# EAGLE design usbSimStepper (EAGLE 5.06)
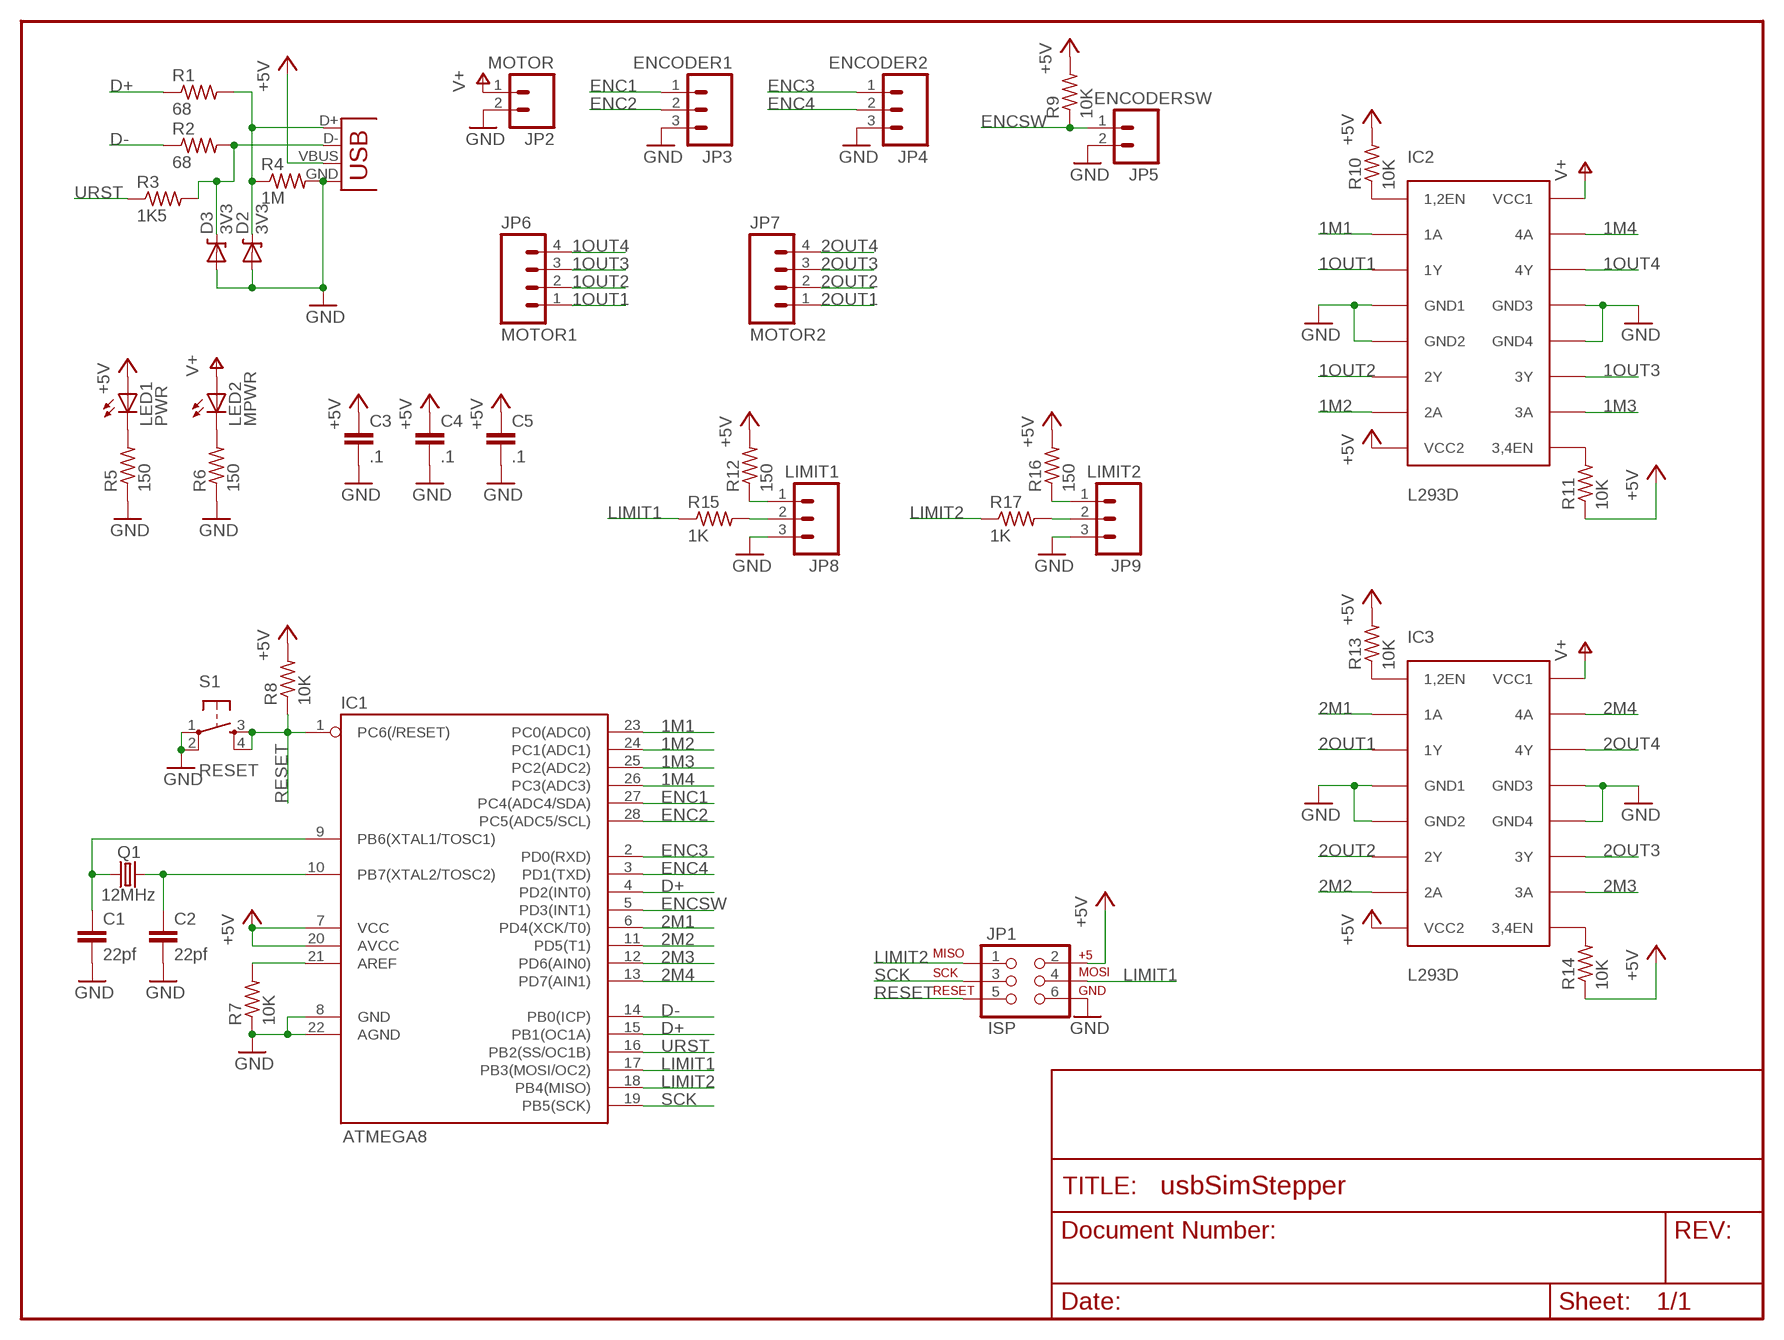
[diagram p0: schematic, sheet 1]

## Parts
C1  22pf  CAPPTH2  [CAP-PTH-SMALL2]
C2  22pf  CAPPTH2  [CAP-PTH-SMALL2]
C3  .1  CAPPTH2  [CAP-PTH-SMALL2]
C4  .1  CAPPTH2  [CAP-PTH-SMALL2]
C5  .1  CAPPTH2  [CAP-PTH-SMALL2]
D2  3V3  DIODE-ZENERPTH  [DIODE-ZENER]
D3  3V3  DIODE-ZENERPTH  [DIODE-ZENER]
IC1  ATMEGA8  AVR-MEGA8-PPTH  [DIL28-3]
IC2  L293D  [DIL16]
IC3  L293D  [DIL16]
JP1  ISP  AVR_SPI_PRG_6NS  [2X3-NS]
JP2  MOTOR  M02POLAR  [MOLEX-1X2]
JP3  ENCODER1  M03POLAR  [MOLEX-1X3]
JP4  ENCODER2  M03POLAR  [MOLEX-1X3]
JP5  ENCODERSW  M02POLAR  [MOLEX-1X2]
JP6  MOTOR1  M04POLAR  [MOLEX-1X4]
JP7  MOTOR2  M04POLAR  [MOLEX-1X4]
JP8  LIMIT1  M03POLAR  [MOLEX-1X3]
JP9  LIMIT2  M03POLAR  [MOLEX-1X3]
LED1  PWR  LED5MM  [LED5MM]
LED2  MPWR  LED5MM  [LED5MM]
Q1  12MHz  CRYSTALHC49US  [HC49US]
R1  68  R-US_0204/7  [0204/7]
R2  68  R-US_0204/7  [0204/7]
R3  1K5  R-US_0204/7  [0204/7]
R4  1M  R-US_0204/7  [0204/7]
R5  150  R-US_0204/7  [0204/7]
R6  150  R-US_0204/7  [0204/7]
R7  10K  R-US_0204/7  [0204/7]
R8  10K  R-US_0204/7  [0204/7]
R9  10K  R-US_0204/7  [0204/7]
R10  10K  R-US_0204/7  [0204/7]
R11  10K  R-US_0204/7  [0204/7]
R12  150  R-US_0204/7  [0204/7]
R13  10K  R-US_0204/7  [0204/7]
R14  10K  R-US_0204/7  [0204/7]
R15  1K  R-US_0204/7  [0204/7]
R16  150  R-US_0204/7  [0204/7]
R17  1K  R-US_0204/7  [0204/7]
S1  RESET  TAC_SWITCHPTH  [TACTILE-PTH]
X1  USB  USBPTH-VERTICAL  [USB-B-PTH-VERTICAL]

## Nets
1M1: IC1.23(PC0(ADC0)) IC2.2(1A)
1M2: IC1.24(PC1(ADC1)) IC2.7(2A)
1M3: IC1.25(PC2(ADC2)) IC2.10(3A)
1M4: IC1.26(PC3(ADC3)) IC2.15(4A)
1OUT1: IC2.3(1Y) JP6.1
1OUT2: IC2.6(2Y) JP6.2
1OUT3: IC2.11(3Y) JP6.3
1OUT4: IC2.14(4Y) JP6.4
2M1: IC1.6(PD4(XCK/T0)) IC3.2(1A)
2M2: IC1.11(PD5(T1)) IC3.7(2A)
2M3: IC1.12(PD6(AIN0)) IC3.10(3A)
2M4: IC1.13(PD7(AIN1)) IC3.15(4A)
2OUT1: IC3.3(1Y) JP7.1
2OUT2: IC3.6(2Y) JP7.2
2OUT3: IC3.11(3Y) JP7.3
2OUT4: IC3.14(4Y) JP7.4
+5V: C3.1 C4.1 C5.1 IC1.7(VCC) IC1.20(AVCC) IC2.8(VCC2) IC3.8(VCC2) JP1.2 LED1.A R8.2 R9.2 R10.2 R11.1 R12.2 R13.2 R14.1 R16.2 X1.VBUS
D+: IC1.4(PD2(INT0)) IC1.15(PB1(OC1A)) R1.1
D-: IC1.14(PB0(ICP)) R2.1
ENC1: IC1.27(PC4(ADC4/SDA)) JP3.1
ENC2: IC1.28(PC5(ADC5/SCL)) JP3.2
ENC3: IC1.2(PD0(RXD)) JP4.1
ENC4: IC1.3(PD1(TXD)) JP4.2
ENCSW: IC1.5(PD3(INT1)) JP5.1 R9.1
GND: C1.2 C2.2 C3.2 C4.2 C5.2 D2.P$2(A) D3.P$2(A) IC1.8(GND) IC1.22(AGND) IC2.4(GND1) IC2.5(GND2) IC2.12(GND4) IC2.13(GND3) IC3.4(GND1) IC3.5(GND2) IC3.12(GND4) IC3.13(GND3) JP1.6 JP2.2 JP3.3 JP4.3 JP5.2 JP8.3 JP9.3 R4.2 R5.1 R6.1 R7.1 S1.1 S1.2 X1.GND
LIMIT1: IC1.17(PB3(MOSI/OC2)) JP1.4 R15.1
LIMIT2: IC1.18(PB4(MISO)) JP1.1 R17.1
N$1: D3.P$1(C) R2.2 R3.2 X1.D-
N$2: D2.P$1(C) R1.2 R4.1 X1.D+
N$3: LED1.K(C) R5.2
N$4: LED2.K(C) R6.2
N$5: C1.1 IC1.9(PB6(XTAL1/TOSC1)) Q1.1
N$6: C2.1 IC1.10(PB7(XTAL2/TOSC2)) Q1.2
N$7: IC1.21(AREF) R7.2
N$8: JP8.1 R12.1
N$9: JP8.2 R15.2
N$10: JP9.1 R16.1
N$11: IC3.1(1,2EN) R13.1
N$12: IC3.9(3,4EN) R14.2
N$13: IC2.1(1,2EN) R10.1
N$14: IC2.9(3,4EN) R11.2
N$15: JP9.2 R17.2
RESET: IC1.1(PC6(/RESET)) JP1.5 R8.1 S1.3 S1.4
SCK: IC1.19(PB5(SCK)) JP1.3
URST: IC1.16(PB2(SS/OC1B)) R3.1
V+: IC2.16(VCC1) IC3.16(VCC1) JP2.1 LED2.A

## Library data of the parts
C1-C5 = SparkFun:CAP: Capacitor Standard 0603 ceramic capacitor, and 0.1" leaded capacitor.
D2 D3 = SparkFun:DIODE-ZENER: Zener Diode Production Part - 8199 3.4V Zener Voltage
IC1 = SparkFun:AVR-MEGA8-P: MICROCONTROLLER 8 Kbytes FLASH 1 kbytes SRAM 512 bytes EEPROM USART 4-channel 10 bit ADC 2-channel 8 bit ADC
IC2 IC3 = sgs-thom:L293D
JP1 = SparkFun:AVR_SPI_PRG_6: AVR ISP 6 Pin This is the reduced ISP connector for AVR programming. Common on Arduino. This footprint will take up less PCB space and can be used with a 10-pin to 6-pin adapter such as SKU: BOB-08508
JP2 JP5 = SparkFun:M02: Header 2 Standard 2-pin 0.1" header. Use with straight break away headers (SKU : PRT-00116), right angle break away headers (PRT-00553), swiss pins (PRT-00743), machine pins (PRT-00117), and female headers (PRT-00115). Molex polarized connector foot print use with SKU : PRT-08233 with associated crimp pins and housings.
JP3 JP4 JP8 JP9 = SparkFun:M03: Header 3 Standard 3-pin 0.1" header. Use with straight break away headers (SKU : PRT-00116), right angle break away headers (PRT-00553), swiss pins (PRT-00743), machine pins (PRT-00117), and female headers (PRT-00115). Molex polarized connector foot print use with SKU : PRT-08232 with associated crimp pins and housings.
JP6 JP7 = SparkFun:M04: Header 4 Standard 4-pin 0.1" header. Use with straight break away headers (SKU : PRT-00116), right angle break away headers (PRT-00553), swiss pins (PRT-00743), machine pins (PRT-00117), and female headers (PRT-00115). Molex polarized connector foot print use with SKU : PRT-08231 with associated crimp pins and housings.
LED1 LED2 = SparkFun:LED: LEDs Standard schematic elements and footprints for 5mm, 3mm, 1206, and 0603 sized LEDs. 5mm - Spark Fun Electronics SKU : COM-00529 (and others)
Q1 = SparkFun:CRYSTAL: Crystals Various standard crystals. Proven footprints. Spark Fun Electronics SKU : COM-00534
R1-R17 = resistor:R-US_: RESISTOR, American symbol
S1 = SparkFun:TAC_SWITCH: Momentary Switch Button commonly used for reset or general input. Spark Fun Electronics SKU : COM-00097
X1 = SparkFun:USB: USB Connectors USB-B-PTH is fully proven SKU : PRT-00139 USB-miniB is fully proven SKU : PRT-00587 USB-A-PCB is untested. USB-A-H is throughly reviewed, but untested. Spark Fun Electronics SKU : PRT-00437 USB-B-SMT is throughly reviewed, but untested. Needs silkscreen touching up. USB-A-S has not been used/tested USB-MB-H has not been used/tested

## Board
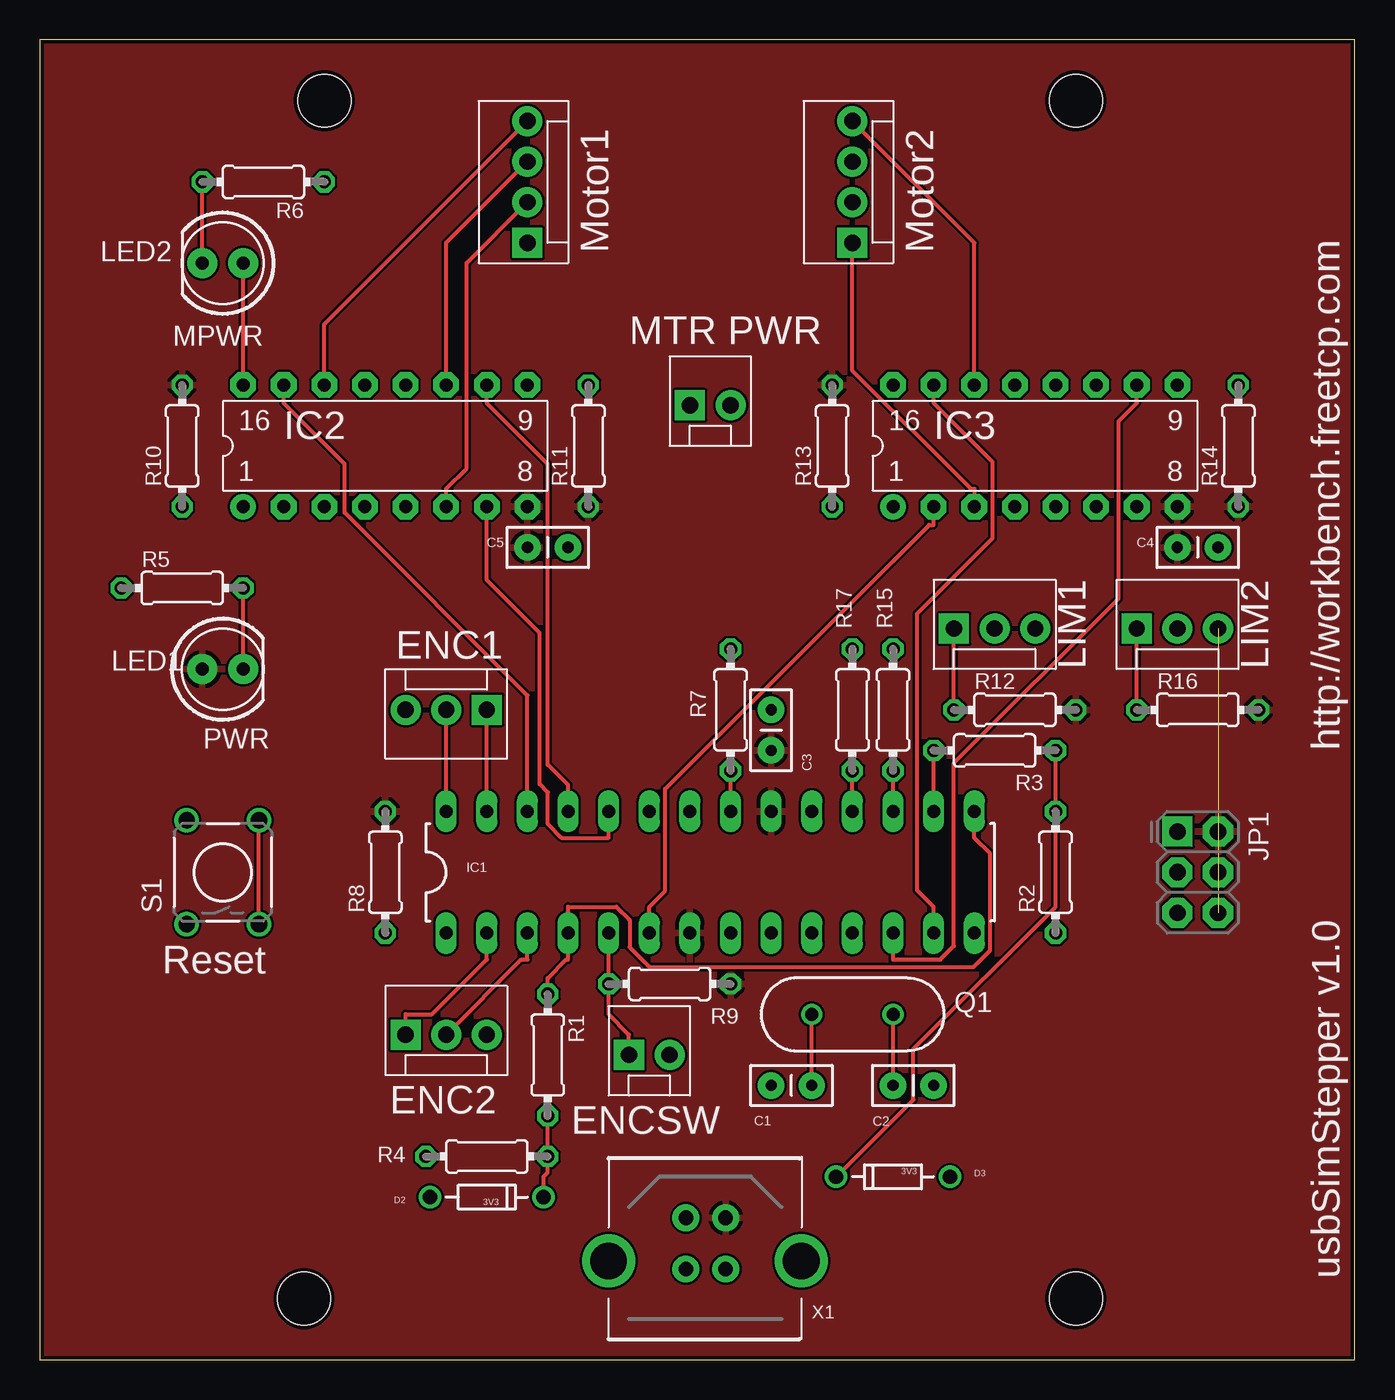
[diagram p1: board, top side]
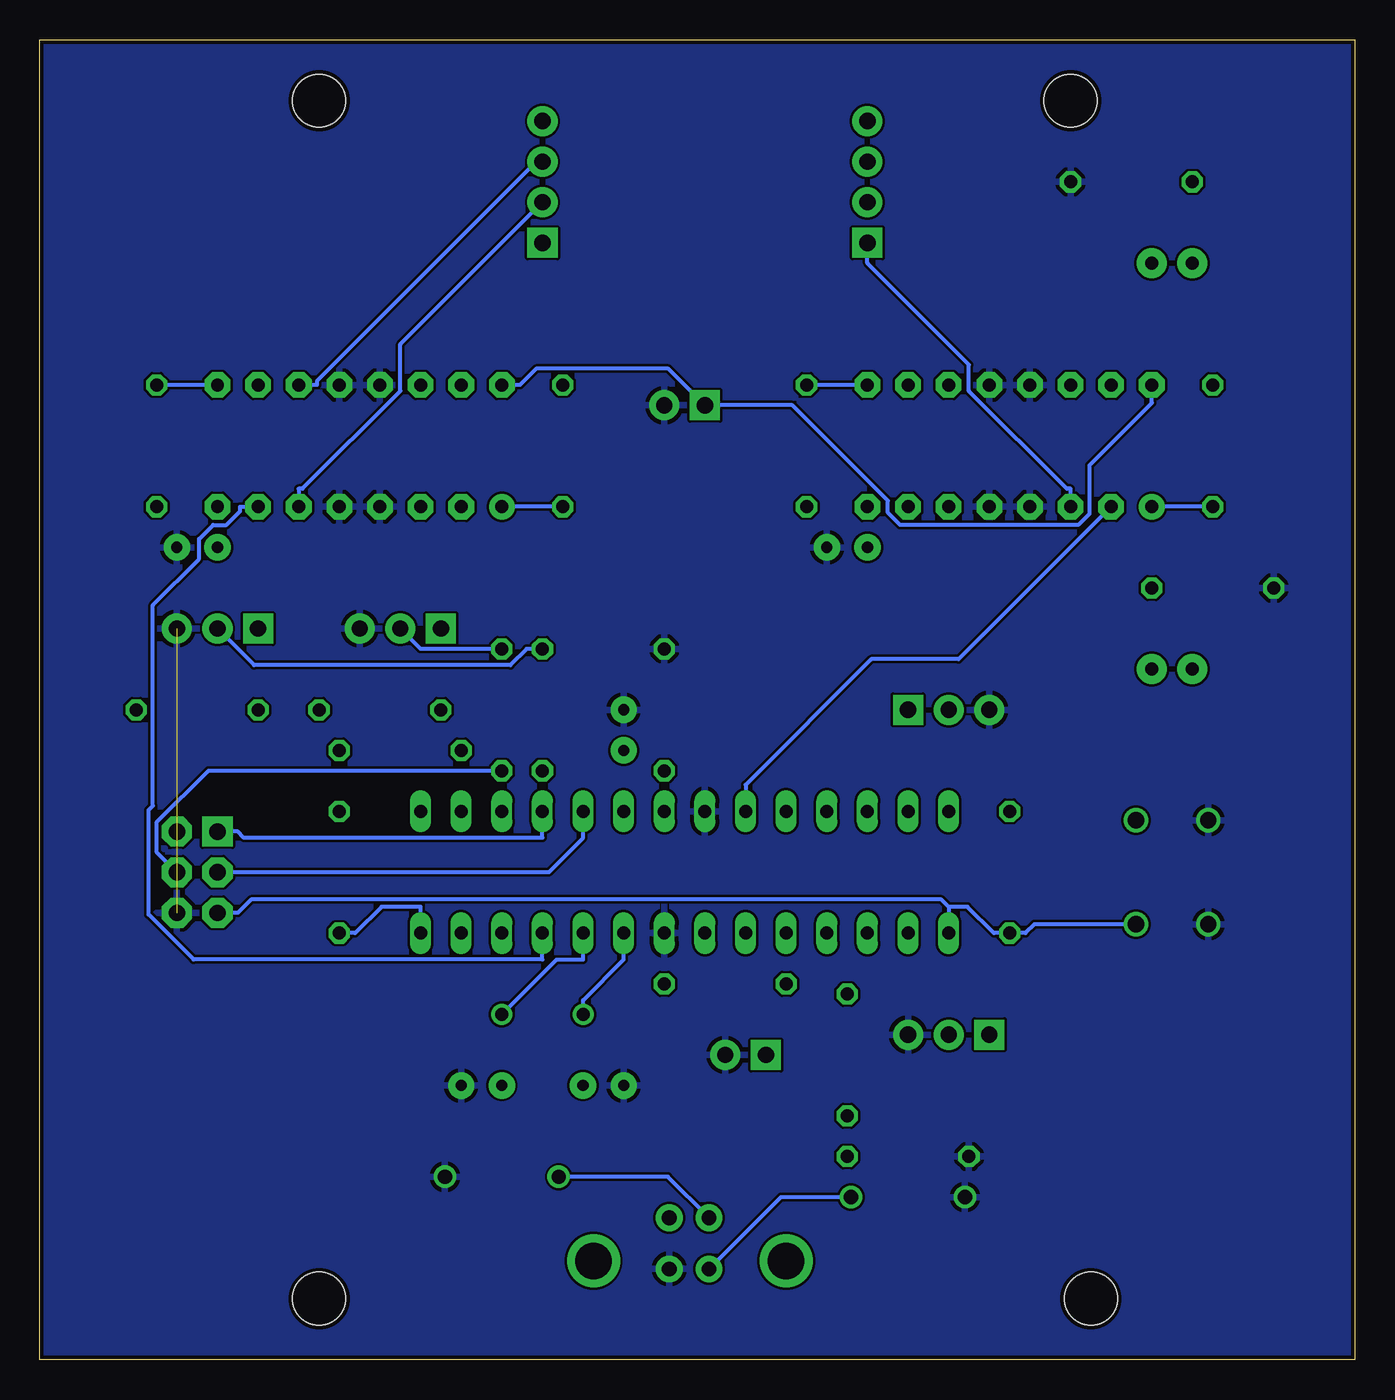
[diagram p2: board, bottom side, seen from below]

Size 82.22 x 82.54 mm. Coordinates in mm from the lower left corner, seen from the top.
Outline: 0,0 82.22,0 82.22,82.54 0,82.54 0,0
Copper layers (1*16): Top 0.035mm / dielectric 1.5mm / Bottom 0.035mm
Design rules "PropagandaPCB": minimum track width 6mil, minimum drill 10mil, track to track 6mil, track to pad 6mil, pad to pad 6mil, via to via 6mil, smd to smd 6mil, copper to edge 10mil, drill to drill 10mil, minimum pad ring 10mil, minimum via ring 6mil, stop-mask expansion 2mil, vias tented up to drill 100mil, thermal gap 10mil

### Footprints (pad centres in the part's own frame; a part is rotated, then mirrored left to right if it is on the bottom)
CAP-PTH-SMALL2 = drill 0.7 pad 1.651 round: 1 0,0; 2 2.54,0
DIODE-ZENER = drill 0.9 round: P$1 -3.556,0; P$2 3.556,0
DIL28-3 = drill 0.813 long: 1 -16.51,-3.81; 2 -13.97,-3.81; 3 -11.43,-3.81; 4 -8.89,-3.81; 5 -6.35,-3.81; 6 -3.81,-3.81; 7 -1.27,-3.81; 8 1.27,-3.81; 9 3.81,-3.81; 10 6.35,-3.81; 11 8.89,-3.81; 12 11.43,-3.81; 13 13.97,-3.81; 14 16.51,-3.81; 15 16.51,3.81; 16 13.97,3.81; 17 11.43,3.81; 18 8.89,3.81; 19 6.35,3.81; 20 3.81,3.81; 21 1.27,3.81; 22 -1.27,3.81; 23 -3.81,3.81; 24 -6.35,3.81; 25 -8.89,3.81; 26 -11.43,3.81; 27 -13.97,3.81; 28 -16.51,3.81
DIL16 = drill 0.813 pad 1.6 round: 1 -8.89,-3.81 | drill 0.813 pad 1.6 octagon: 2 -6.35,-3.81; 3 -3.81,-3.81; 4 -1.27,-3.81; 5 1.27,-3.81; 6 3.81,-3.81; 7 6.35,-3.81; 8 8.89,-3.81; 9 8.89,3.81; 10 6.35,3.81; 11 3.81,3.81; 12 1.27,3.81; 13 -1.27,3.81; 14 -3.81,3.81; 15 -6.35,3.81; 16 -8.89,3.81
2X3-NS = drill 1.016 pad 1.88 square: 1 -2.54,-1.27 | drill 1.016 pad 1.88 octagon: 2 -2.54,1.27; 3 0,-1.27; 4 0,1.27; 5 2.54,-1.27; 6 2.54,1.27
MOLEX-1X2 = drill 1.016 pad 1.88 square: 1 0,0 | drill 1.016 pad 1.88 round: 2 2.54,0
MOLEX-1X3 = drill 1.016 pad 1.88 square: 1 0,0 | drill 1.016 pad 1.88 round: 2 2.54,0; 3 5.08,0
MOLEX-1X4 = drill 1.016 pad 1.88 square: 1 0,0 | drill 1.016 pad 1.88 round: 2 2.54,0; 3 5.08,0; 4 7.62,0
LED5MM = drill 0.813 pad 1.88 round: A -1.27,0; K 1.27,0
HC49US = drill 0.813 round: 1 -2.54,0; 2 2.54,0
0204/7 = drill 0.813 octagon: 1 -3.81,0; 2 3.81,0
TACTILE-PTH = drill 1.016 round: 1 -3.251,2.261; 2 3.251,2.261; 3 -3.251,-2.261; 4 3.251,-2.261
STAND-OFF = hole 3.302: 0,0
USB-B-PTH-VERTICAL = drill 0.914 pad 1.676 round: D+ 4.826,4.394; D- 4.826,7.595; GND 7.315,4.394; VBUS 7.315,7.595 | drill 2.286 round: P$1 0,4.902; P$2 12.04,4.902

### Placement (x,y rotation side)
C1  48.26,17.14 180 top
C2  53.34,17.14 0 top
C3  45.72,38.1 90 top
C4  71.12,50.8 0 top
C5  30.48,50.8 0 top
D2  27.94,10.16 180 top
D3  53.34,11.43 0 top
IC1  41.91,30.48 0 top
IC2  21.59,57.15 0 top
IC3  62.23,57.15 0 top
JP1  72.39,30.48 270 top
JP2  40.64,59.69 0 top
JP3  27.94,40.64 180 top
JP4  22.86,20.32 0 top
JP5  36.83,19.05 0 top
JP6  30.48,69.85 90 top
JP7  50.8,69.85 90 top
JP8  57.15,45.72 0 top
JP9  68.58,45.72 0 top
LED1  11.43,43.18 0 top
LED2  11.43,68.58 180 top
Q1  50.8,21.59 0 top
R1  31.75,19.05 270 top
R2  63.5,30.48 90 top
R3  59.69,38.1 0 top
R4  27.94,12.7 180 top
R5  8.89,48.26 0 top
R6  13.97,73.66 180 top
R7  43.18,40.64 270 top
R8  21.59,30.48 90 top
R9  39.37,23.5 0 top
R10  8.89,57.15 90 top
R11  34.29,57.15 90 top
R12  60.96,40.64 0 top
R13  49.53,57.15 90 top
R14  74.93,57.15 90 top
R15  53.34,40.64 90 top
R16  72.39,40.64 0 top
R17  50.8,40.64 90 top
S1  11.43,30.48 90 top
U$1  [STAND-OFF]  16.51,3.81 0 top
U$2  [STAND-OFF]  64.77,3.81 0 top
U$3  [STAND-OFF]  17.78,78.74 0 top
U$4  [STAND-OFF]  64.77,78.74 0 top
X1  35.56,1.27 0 top

### Tracks (layer width: path | path; a pad name or v marks a point on that pad's centre or on a via)
1M1
  Bottom 0.254: IC1.23 38.1,35.94 30.23,43.81 24.77,43.81 IC2.2
1M2
  Top 0.254: IC1.24 35.56,32.64 32.61,32.64 31.75,33.5 31.75,35.48 31.24,35.99 31.24,45.45 27.94,48.75 IC2.7
1M3
  Top 0.254: IC1.25 33.02,35.94 31.75,37.21 31.75,56.02 27.94,59.83 IC2.10
1M4
  Top 0.254: IC2.15 15.24,59.83 19.05,56.02 19.05,52.97 30.48,41.54 IC1.26
1OUT1
  Bottom 0.254: IC2.3 17.78,54.47 18.01,54.47 24.13,60.59 24.13,62.23 30.48,68.58 JP6.1
1OUT2
  Top 0.254: IC2.6 25.4,54.47 26.67,55.74 26.67,68.58 JP6.2
1OUT3
  Top 0.254: JP6.3 25.4,69.85 IC2.11
1OUT4
  Top 0.254: JP6.4 17.78,64.77 IC2.14
2M1
  Top 0.254: IC1.6 38.1,28.32 39.09,29.31 39.09,35.7 55.6,52.21 55.88,52.21 IC3.2
2M2
  Bottom 0.254: IC1.11 50.8,25.02 72.61,25.02 75.42,27.83 75.42,34.37 75.16,34.63 75.16,47.19 72.28,50.07 72.28,51.32 71.39,52.21 70.56,52.21 69.71,53.06 69.71,53.34 IC3.7
2M3
  Top 0.254: IC1.12 53.34,25.02 56.31,25.02 57.15,25.86 57.15,37.32 67.45,47.62 67.45,58.7 68.58,59.83 IC3.10
2M4
  Top 0.254: IC1.13 55.88,28.32 54.85,29.35 54.85,46.66 59.57,51.38 59.57,56.14 55.88,59.83 IC3.15
2OUT1
  Top 0.254: IC3.3 58.42,54.47 58.19,54.47 50.8,61.86 JP7.1
2OUT2
  Bottom 0.254: IC3.6 66.04,54.47 65.81,54.47 59.69,60.59 59.69,63.5 JP7.2
2OUT3
  Bottom 0.254: IC3.11 64.91,60.96 64.91,61.19 51.17,74.93 JP7.3
2OUT4
  Top 0.254: JP7.4 58.42,69.85 IC3.14
+5V
  pour Top: 0,0 82.55,0 82.55,82.55 0,82.55
D+
  Top 0.254: R1.1 31.75,23.85 32.92,25.02 33.02,25.02 IC1.4 33.02,28.32 36.04,28.32 36.87,27.49 36.87,25.78 38.1,24.55 58.37,24.55 59.41,25.59 59.41,31.65 58.42,32.64 IC1.15
D-
  Bottom 0.254: R2.1 62.51,26.67 60.86,28.32 58.42,28.32 IC1.14
ENC1
  Top 0.254: IC1.27 JP3.1
ENC2
  Top 0.254: IC1.28 JP3.2
ENC3
  Top 0.254: IC1.2 27.94,25.02 24.51,21.59 22.86,21.59 JP4.1
ENC4
  Top 0.254: IC1.3 30.48,25.02 30.1,25.02 JP4.2
ENCSW
  Top 0.254: JP5.1 36.83,20.32 35.56,21.59 R9.1 IC1.5
GND  (1 unrouted)
  pour Bottom: 0,0 82.55,0 82.55,82.55 0,82.55
LIMIT1
  Top 0.254: IC1.17 R15.1
  Bottom 0.254: R15.1 71.69,36.83 74.93,33.59 74.93,31.75 JP1.4
LIMIT2
  Top 0.254: IC1.18 R17.1
  Bottom 0.254: IC1.18 50.8,32.64 69.47,32.64 69.85,33.02 JP1.1
N$1
  Top 0.254: D3.P$1 54.61,16.26 54.61,19.43 63.5,28.32 R2.2 R3.2
  Bottom 0.254: X1.D- 42.95,11.43 D3.P$1
N$2
  Top 0.254: D2.P$1 31.5,11.46 31.75,11.71 R4.1 R1.2
  Bottom 0.254: X1.D+ 35.89,10.16 D2.P$1
N$3
  Top 0.254: LED1.K R5.2
N$4
  Top 0.254: LED2.K R6.2
N$5
  Top 0.254: C1.1 Q1.1
  Bottom 0.254: IC1.9 45.72,25.02 48.26,22.48 Q1.1
N$6
  Top 0.254: C2.1 Q1.2
  Bottom 0.254: IC1.10 48.26,25.02 49.91,25.02 Q1.2
N$7
  Top 0.254: IC1.21 R7.2
N$8
  Top 0.254: R12.1 JP8.1
N$9
  Bottom 0.254: R15.2 54.33,44.45 | 54.33,44.45 | 54.33,44.45 58.42,44.45 JP8.2
N$10
  Top 0.254: R16.1 JP9.1
N$11
  Bottom 0.254: R13.1 IC3.1
N$12
  Bottom 0.254: IC3.9 R14.2
N$13
  Bottom 0.254: R10.1 IC2.1
N$14
  Bottom 0.254: IC2.9 R11.2
N$15
  Bottom 0.254: R17.2 51.79,44.45 52.81,43.43 68.83,43.43 JP9.2
RESET
  Top 0.254: S1.3 S1.4
  Bottom 0.254: S1.3 20.04,27.23 20.6,26.67 R8.1 22.58,26.67 24.23,28.32 25.4,28.32 | JP1.5 69.85,27.94 69.01,28.78 25.86,28.78 25.4,28.32 | 25.4,28.32 IC1.1
SCK
  Bottom 0.254: IC1.19 48.26,32.64 50.42,30.48 JP1.3
URST
  Top 0.254: IC1.16 R3.1
V+
  Top 0.254: IC2.16 LED2.A
  Bottom 0.254: IC2.16 12.7,59.83 16.58,55.95 16.58,52.93 17.31,52.2 28.44,52.2 29.21,52.97 29.21,53.73 35.17,59.69 JP2.1 42.92,61.97 51.2,61.97 52.21,60.96 IC3.16

### Text on the board
tPlace: Motor1 | Motor2 | MTR PWR | ENC1 | LIM1 | LIM2 | http://workbench.freetcp.com | Reset | ENC2 | ENCSW | usbSimStepper v1.0